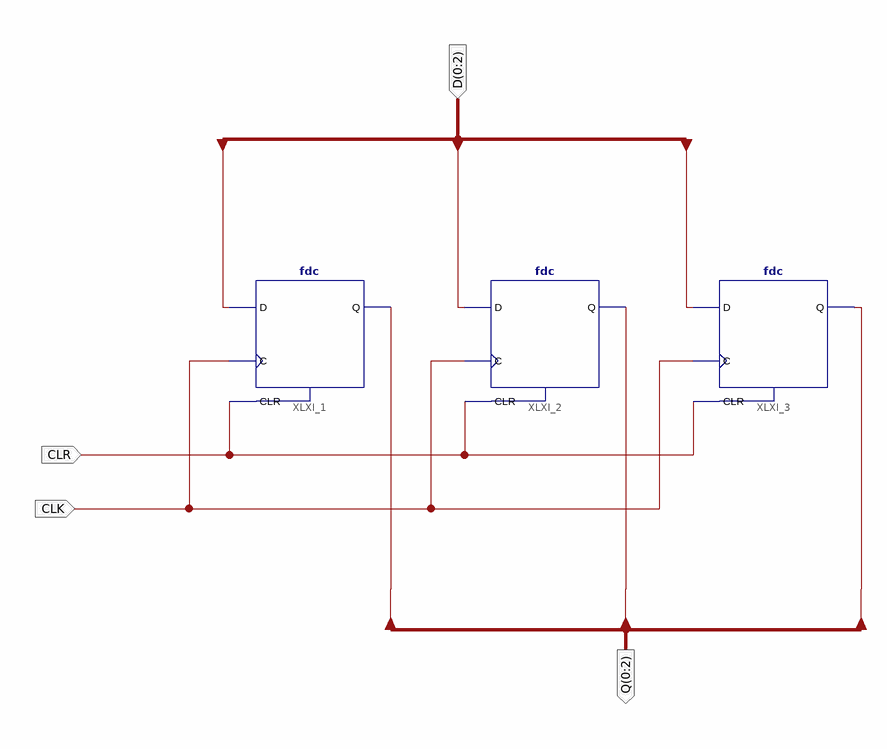
[diagram p0: schematic sheet 1]
// Xilinx ISE schematic bit_3_pc.sch (spartan3e) as structural Verilog: 3 symbols, 4 ports
module bit_3_pc (
  input  CLK,
  input  CLR,
  input  [0:2] D,
  output [0:2] Q
);

  fdc XLXI_1 (.C(CLK), .CLR(CLR), .D(D[0]), .Q(Q[0]));
  fdc XLXI_2 (.C(CLK), .CLR(CLR), .D(D[1]), .Q(Q[1]));
  fdc XLXI_3 (.C(CLK), .CLR(CLR), .D(D[2]), .Q(Q[2]));
endmodule
